# Altium schematic sheet BACKPMAN30_Intfs.SchDoc
size A3
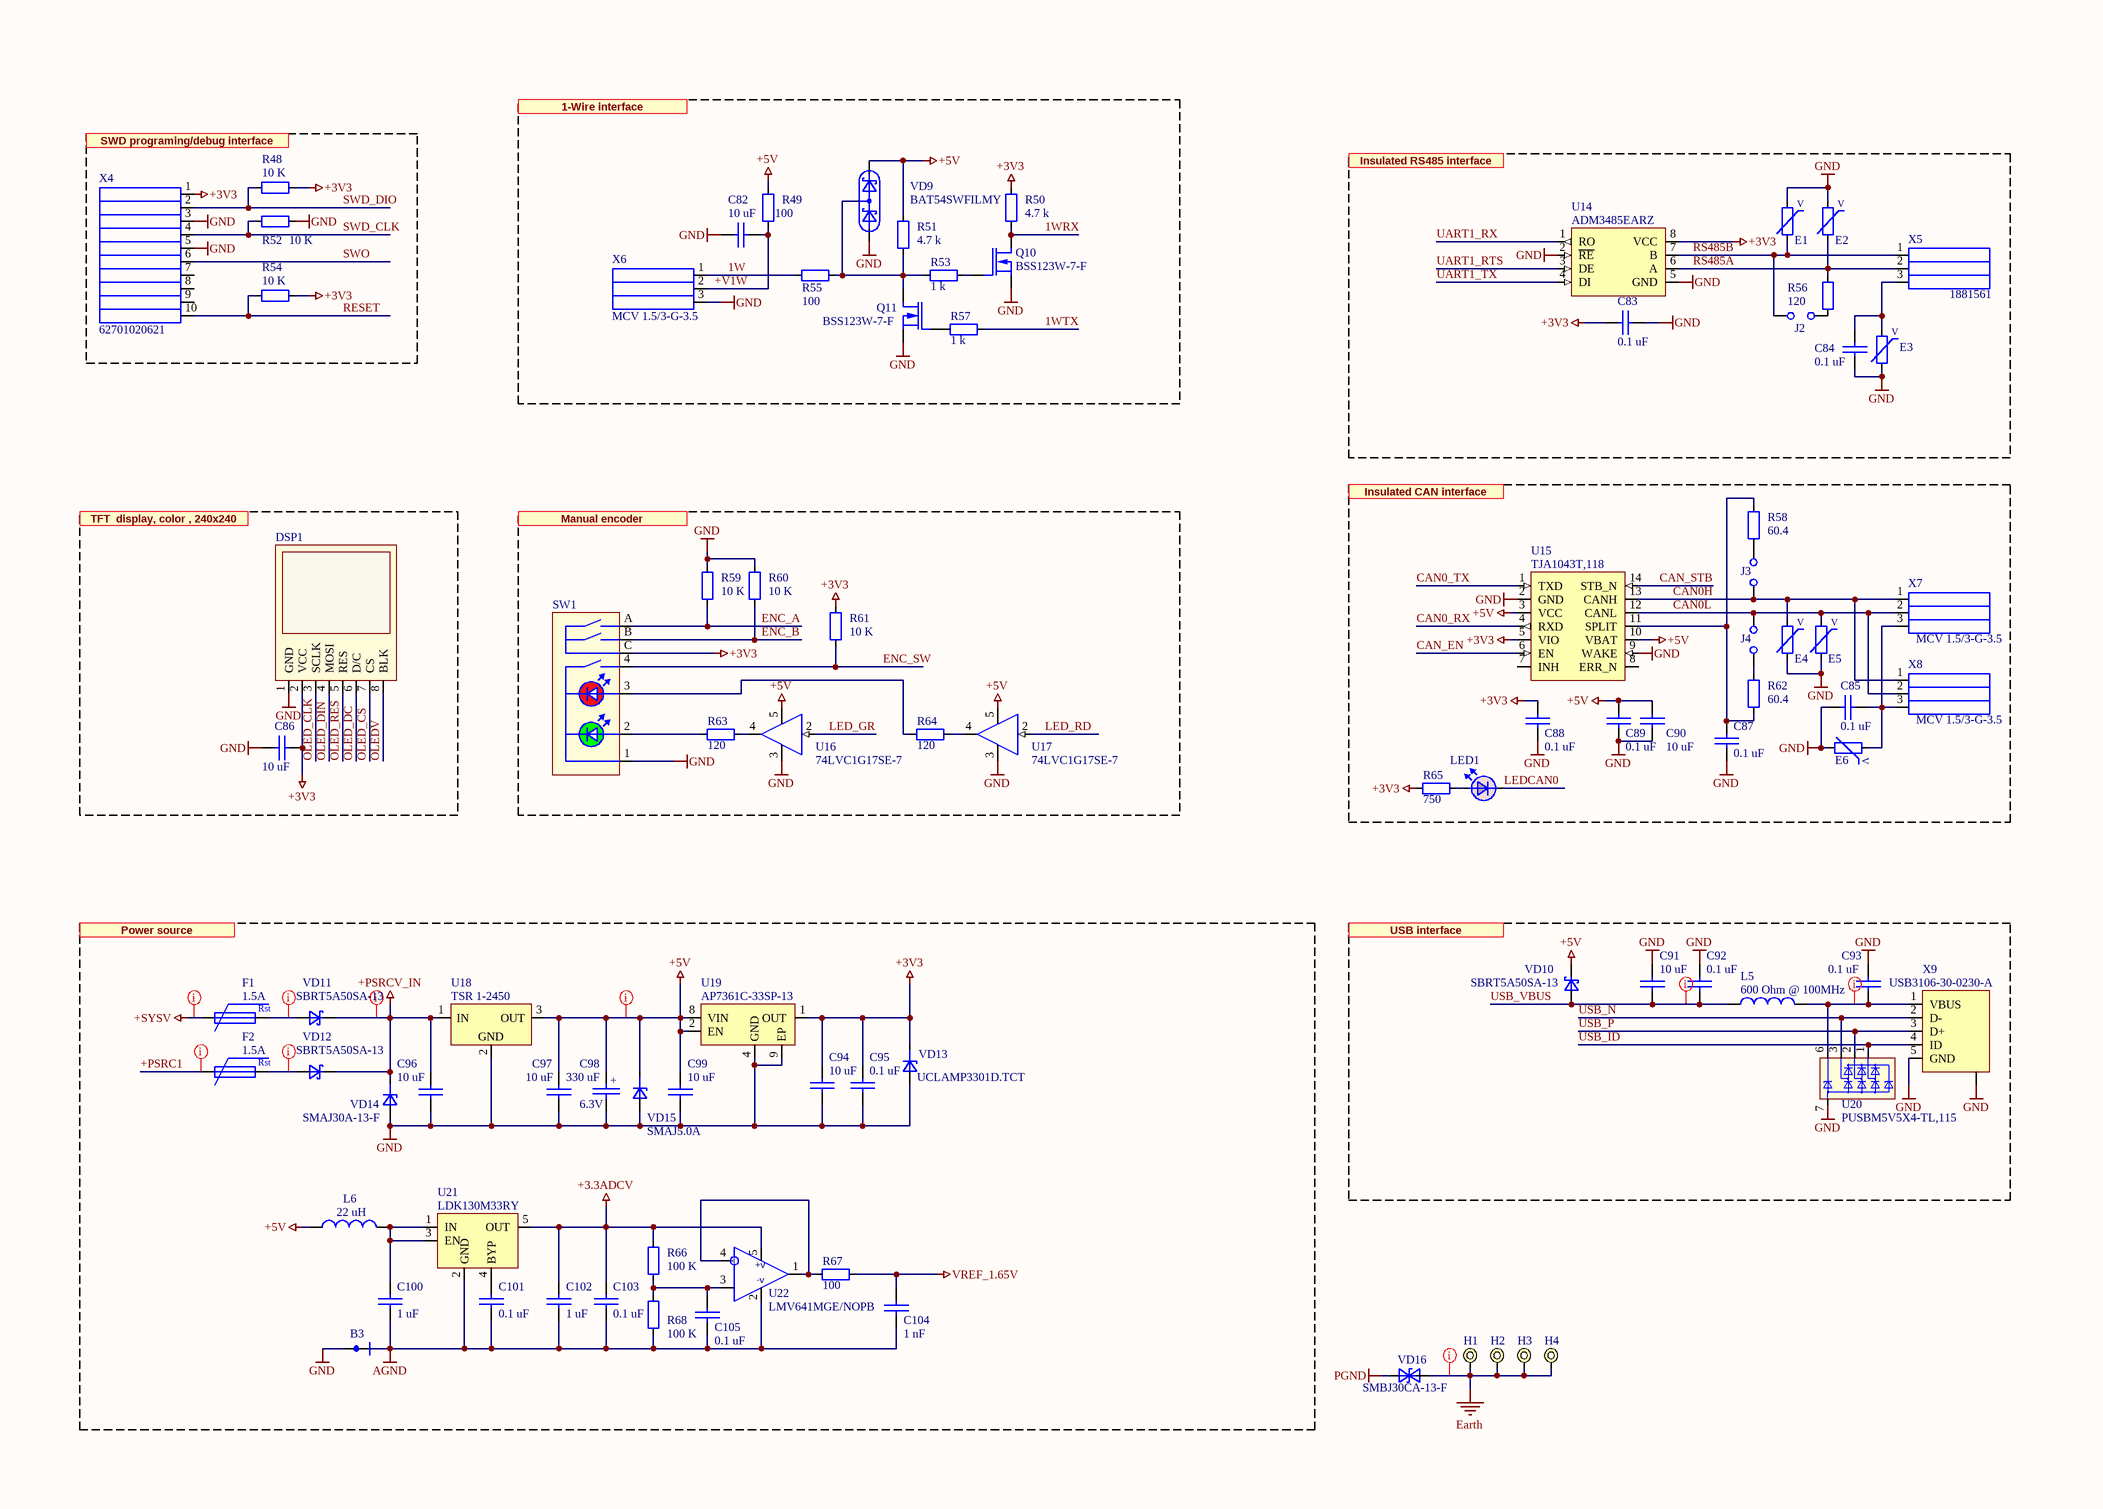
[diagram p0: BACKPMAN30_Intfs.SchDoc]

## Parts
B3  Net tie 0.3mm  [Net tee 0.3 mm]  (value not drawn)  (net tie, no BOM)
C82  value 10 uF  [2012[0805]]  (hidden comment: GRM21BR61E106KA73L)
C83  value 0.1 uF  [1608[0603]]  (hidden comment: 0603B104K500CT)
C84  value 0.1 uF  [1608[0603]]  (hidden comment: CL10B104KA8NNND)
C85  value 0.1 uF  [1608[0603]]  (hidden comment: CL10B104KA8NNND)
C86  value 10 uF  [2012[0805]]  (hidden comment: GRM21BR61E106KA73L)
C87  value 0.1 uF  [1608[0603]]  (hidden comment: CL10B104KA8NNND)
C88  value 0.1 uF  [1608[0603]]  (hidden comment: CL10B104KA8NNND)
C89  value 0.1 uF  [1608[0603]]  (hidden comment: CL10B104KA8NNND)
C90  value 10 uF  [2012[0805]]  (hidden comment: GRM21BR61E106KA73L)
C91  value 10 uF  [2012[0805]]  (hidden comment: GRM21BR61E106KA73L)
C92  value 0.1 uF  [1608[0603]]  (hidden comment: CL10B104KA8NNND)
C93  value 0.1 uF  [1608[0603]]  (hidden comment: CL10B104KA8NNND)
C94  value 10 uF  [2012[0805]]  (hidden comment: GRM21BR61E106KA73L)
C95  value 0.1 uF  [1608[0603]]  (hidden comment: CL10B104KA8NNND)
C96  value 10 uF  [3225[1210]]  (hidden comment: GMC32X7R106K50NT)
C97  value 10 uF  [2012[0805]]  (hidden comment: GRM21BR61E106KA73L)
C98  value 330 uF  Voltage: 6.3V  [T495 D]  (hidden comment: T495D337K006ATE100)
C99  value 10 uF  [2012[0805]]  (hidden comment: GRM21BR61E106KA73L)
C100  value 1 uF  [1608[0603]]  (hidden comment: C1608X5R1H105K080AB)
C101  value 0.1 uF  [1608[0603]]  (hidden comment: 0603B104K500CT)
C102  value 1 uF  [1608[0603]]  (hidden comment: C1608X5R1H105K080AB)
C103  value 0.1 uF  [1608[0603]]  (hidden comment: 0603B104K500CT)
C104  value 1 nF  [0603 CAP]  (hidden comment: Capacitor)
C105  value 0.1 uF  [1608[0603]]  (hidden comment: 0603B104K500CT)
DSP1  1.54_inch_IPS_Module  [1.54 inch IPS 240x240]  (value not drawn)
E1  ESD03A5V5R17V  [0603]  (value not drawn)
E2  ESD03A5V5R17V  [0603]  (value not drawn)
E3  823 560 505 60  [0603]  (value not drawn)
E4  ESD03A5V5R17V  [0603]  (value not drawn)
E5  ESD03A5V5R17V  [0603]  (value not drawn)
E6  ESD03A5V5R17V  [0603]  (value not drawn)
F1  value 1.5A  [2920 (7351 Metric)]  (hidden comment: 0ZCF0075AF2C)
F2  value 1.5A  [2920 (7351 Metric)]  (hidden comment: 0ZCF0075AF2C)
H1  Hole 5MM Plated  [HOLE_5MM plated]  (value not drawn)  (no BOM)
H2  Hole 5MM Plated  [HOLE_5MM plated]  (value not drawn)  (no BOM)
H3  Hole 5MM Plated  [HOLE_5MM plated]  (value not drawn)  (no BOM)
H4  Hole 5MM Plated  [HOLE_5MM plated]  (value not drawn)  (no BOM)
J2  PH1-02-TA-HT  [HDR1X2V]  (value not drawn)
J3  PH1-02-TA-HT  [HDR1X2V]  (value not drawn)
J4  PH1-02-TA-HT  [HDR1X2V]  (value not drawn)
L5  value 600 Ohm @ 100MHz  [0805]  (hidden comment: MPZ2012S601AT000)
L6  value 22 uH  [2518]  (hidden comment: BRC2518T220K)
LED1  SML-211UTT86  [0805 LED]  (value not drawn)
Q10  BSS123W-7-F  [SOT323-3]
Q11  BSS123W-7-F  [SOT323-3]
R48  value 10 K  [0603]  (hidden comment: RMCF0603FT10K0)
R49  value 100  [0603]  (hidden comment: Resistor)
R50  value 4.7 k  [0603]  (hidden comment: Resistor)
R51  value 4.7 k  [0603]  (hidden comment: Resistor)
R52  value 10 K  [0603]  (hidden comment: RMCF0603FT10K0)
R53  value 1 k  [0603]  (hidden comment: Resistor)
R54  value 10 K  [0603]  (hidden comment: RMCF0603FT10K0)
R55  value 100  [0603]  (hidden comment: Resistor)
R56  value 120  [0603]  (hidden comment: Resistor)
R57  value 1 k  [0603]  (hidden comment: Resistor)
R58  value 60.4  [0603]  (hidden comment: Resistor)
R59  value 10 K  [0603]  (hidden comment: RMCF0603FT10K0)
R60  value 10 K  [0603]  (hidden comment: RMCF0603FT10K0)
R61  value 10 K  [0603]  (hidden comment: RMCF0603FT10K0)
R62  value 60.4  [0603]  (hidden comment: Resistor)
R63  value 120  [0603]  (hidden comment: Resistor)
R64  value 120  [0603]  (hidden comment: Resistor)
R65  value 750  [0603]  (hidden comment: Resistor)
R66  value 100 K  [0603]  (hidden comment: RG1608N-104-W-T1)
R67  value 100  [0603]  (hidden comment: Resistor)
R68  value 100 K  [0603]  (hidden comment: RG1608N-104-W-T1)
SW1  PEL12D-4225S-S2024  [PEL12D-4225S-S2024]  (value not drawn)
U14  ADM3485EARZ  [SO-8]
U15  TJA1043T,118  [SOT108-1]
U16  74LVC1G17SE-7  [SOT-353 ON Semi]
U17  74LVC1G17SE-7  [SOT-353 ON Semi]
U18  TSR 1-2450  [TSR 1 Traco Power]
U19  AP7361C-33SP-13  [SOIC-8 EDP]
U20  PUSBM5V5X4-TL,115  [DFN1616-6]
U21  LDK130M33RY  [SOT23-5]
U22  LMV641MGE/NOPB  [SOT-353 ON Semi]
VD9  BAT54SWFILMY  [SOT323-3]
VD10  SBRT5A50SA-13  [SMA]
VD11  SBRT5A50SA-13  [SMA]
VD12  SBRT5A50SA-13  [SMA]
VD13  UCLAMP3301D.TCT  [SOD-323]
VD14  SMAJ30A-13-F  [SMA]
VD15  SMAJ5.0A  [SMA]
VD16  SMBJ30CA-13-F  [DO-214AA_SMBJ BI]
X4  62701020621  [SHF-105-01-L-D-SM]
X5  1881561  [1881561]
X6  MCV 1.5/3-G-3.5  [mcv1.5-3-g_3.5 green + MC 1,5 3-ST-3,5 - 1840379]
X7  MCV 1.5/3-G-3.5  [mcv1.5-3-g_3.5 green + MC 1,5 3-ST-3,5 - 1840379]
X8  MCV 1.5/3-G-3.5  [mcv1.5-3-g_3.5 green + MC 1,5 3-ST-3,5 - 1840379]
X9  USB3106-30-0230-A  [USB3106-30-0230-A]

## Nets
+3.3ADCV: C102.2 C103.1 R66.2 U21.5(OUT) U22.5(V+)
+3V3: C83.1 C86.2 C88.2 C94.2 C95.2 DSP1.2(VCC) R48.2 R50.1 R54.2 R61.2 R65.2 SW1.C U14.8(VCC) U15.5(VIO) U19.1(OUT) VD13.1(C) X4.1
+5V: C89.2 C90.2 C97.2 C98.1 C99.2 L6.1 R49.2 R51.1 U15.3(VCC) U15.10(VBAT) U16.5(VCC) U17.5(VCC) U18.3(OUT) U19.2(EN) U19.8(VIN) VD9.2 VD10.1 VD15.1
+PSRCV_IN: C96.1 U18.1(IN) VD11.1 VD12.1 VD14.1
+SYSV: F1.1
AGND: B3.1 C100.1 C101.2 C102.1 C103.2 C104.2 C105.2 R68.1 U21.2(GND) U22.2(GND)
Earth: H1.0 H2.0 H3.0 H4.0 VD16.2(A)
GND: B3.2 C82.2 C83.2 C84.2 C85.2 C86.1 C87.1 C88.1 C89.1 C90.1 C91.2 C92.2 C93.2 C94.1 C95.1 C96.2 C97.1 C98.2 C99.1 DSP1.1(GND) E1.2 E2.2 E3.1 E4.1 E5.1 E6.1 Q10.2(S) Q11.2(S) R52.2 R59.2 R60.2 SW1.1 U14.2(~{RE}) U14.5(GND) U15.2(GND) U15.9(WAKE) U16.3(GND) U17.3(GND) U18.2(GND) U19.4(GND) U19.9(EP) U20.7 VD9.1 VD13.2(A) VD14.2 VD15.2 X4.3 X4.5 X6.3 X9.0 X9.5(GND)
PGND: VD16.1(C)
VREF_1.65V: C104.1 R67.1
1W: R55.1 X6.1
1WRX: Q10.3(D) R50.2
1WTX: R57.1
+PSRC1: F2.1
+V1W: C82.1 R49.1 X6.2
CAN0_RX: U15.4(RXD)
CAN0_TX: U15.1(TXD)
CAN0H: E4.2 J3.2 U15.13(CANH) X7.1 X8.1
CAN0L: E5.2 J4.1 U15.12(CANL) X7.2 X8.2
CAN_EN: U15.6(EN)
CAN_STB: U15.14(STB_N)
ENC_A: R59.1 SW1.A
ENC_B: R60.1 SW1.B
ENC_SW: R61.1 SW1.4
LED_GR: U16.2(A)
LED_RD: U17.2(A)
LEDCAN0: LED1.2
OLED_CLK: DSP1.3(SCLK)
OLED_CS: DSP1.7(CS)
OLED_DC: DSP1.6(D/C)
OLED_DIN: DSP1.4(MOSI)
OLED_RES: DSP1.5(RES)
OLEDV: DSP1.8(BLK)
RESET: R54.1 X4.10
RS485A: E2.1 R56.2 U14.6(A) X5.2
RS485B: E1.1 J2.1 U14.7(B) X5.1
SWD_CLK: R52.1 X4.4
SWD_DIO: R48.1 X4.2
SWO: X4.6
UART1_RTS: U14.3(DE)
UART1_RX: U14.1(RO)
UART1_TX: U14.4(DI)
USB_ID: U20.1 X9.4(ID)
USB_N: U20.3 X9.2(D-)
USB_P: U20.2 X9.3(D+)
USB_VBUS: C91.1 C92.1 L5.2 VD10.2
NetC84_1: C84.1 E3.2 X5.3
NetC85_1: C85.1 E6.2 X7.3 X8.3
NetC87_2: C87.2 R58.2 R62.1 U15.11(SPLIT)
NetC93_1: C93.1 L5.1 U20.6 X9.1(VBUS)
NetC100_2: C100.2 L6.2 U21.1(IN) U21.3(EN)
NetC101_1: C101.1 U21.4(BYP)
NetC105_1: C105.1 R66.1 R68.2 U22.3(IN+)
NetF1_2: F1.2 VD11.2
NetF2_2: F2.2 VD12.2
NetJ2_2: J2.2 R56.1
NetJ3_1: J3.1 R58.1
NetJ4_2: J4.2 R62.2
NetLED1_1: LED1.1 R65.1
NetQ10_1: Q10.1(G) R53.1
NetQ11_1: Q11.1(G) R57.2
NetQ11_3: Q11.3(D) R51.2 R53.2 R55.2 VD9.3
NetR63_1: R63.1 U16.4(Y)
NetR63_2: R63.2 SW1.2
NetR64_1: R64.1 U17.4(Y)
NetR64_2: R64.2 SW1.3
NetR67_2: R67.2 U22.1(OUT) U22.4(IN-)

Not connected (* = marked no-connect by the designer): U15 7(INH) 8(ERR_N); X4 7 8 9

## Layout directives
net class 24V: +PSRC1, +PSRCV_IN, +SYSV, Earth, NetF1_2, NetF2_2
net class 5V: +5V, NetC93_1, USB_VBUS

## Notes on the sheet
- 1-Wire interface
- SWD programing/debug interface
- Insulated RS485 interface
- Insulated CAN interface
- TFT  display, color , 240x240
- (near R59) Manual encoder
- Power source
- USB interface
- (in symbol 0ZCF0075AF2C) Rst
- (in symbol ESD03A5V5R17V) V
- (in symbol LMV641MGE/NOPB) +v; -v
- (in symbol T495D337K006ATE100) +

## Library data of the parts
C82 C86 C90 C91 C94 C97 C99 = GRM21BR61E106KA73L: 10 µF ±10%, 25V, Ceramic Capacitor X5R 0805 (2012 Metric),  -55°C ~ 85°C; Manufacturer: Murata Electronics; PartNum: 490-5523-1-ND; Distributor: Digi-Key; Price: 0.11$; Tolerance: ±10%; Voltage: 25V; PartName: GRM21BR61E106KA73L
C83-C85 C87-C89 C92 C93 C95 C101 C103 C105 = 0603B104K500CT: 0.1 µF ±10% 50V Ceramic Capacitor X7R 0603 (1608 Metric), -55°C ~ 125°C; Manufacturer: Walsin Technology Corporation; PartNum: 1292-1643-1-ND; Tolerance: +-10%; Distributor: Digi-Key; PartName: 0603B104K500CT; Price: 0.0062 Euro; Voltage: 50V
C96 = GMC32X7R106K50NT: 10 µF ±10%, 50V, Ceramic Capacitor X7R, 1210 (3225 Metric), -55°C ~ 125°C; Manufacturer: CAL-CHIP ELECTRONICS, INC.; PartNum: 2571-GMC32X7R106K50NTTR-ND; Distributor: Digi-Key; PartName: GMC32X7R106K50NT; Tolerance: ±10%; Voltage: 50V
C98 = T495D337K006ATE100: 330 µF Molded Tantalum Capacitors 6.3 V 2917 (7343 Metric) 100mOhm, -55°C ~ 125°C; Manufacturer: KEMET; PartNum: 399-3883-1-ND; Tolerance: ±10%; Distributor: Digi-Key; Price: 0.089 Euro; PartName: T495D337K006ATE100
C100 C102 = C1608X5R1H105K080AB: 1 uF, ±10%, Low ESL, 50V, Ceramic Capacitor X5R 0603 (1608 Metric), -55°C ~ 85°C; Manufacturer: Venkel; PartNum: 445-7468-1-ND; Distributor: Digi-Key; PartName: C1608X5R1H105K080AB; Tolerance: ±10%; Voltage: 50V
C104 = CC0603JRX7R9BB102: 1000pF, ±5%, 50V, X7R, 0603 (1608 Metric), -55°C ~ 125°C, -, General Purpose; Manufacturer: Yageo; PartNum: 311-3361-1-ND; Voltage - Rated: 50V; Part Number: CC0603JRX7R9BB102; Distributor: Digi-Key; PartName: CC0603JRX7R9BB102; Price: 0.01920; Tolerance: ±5%; Temperature Coefficient: X7R; Operating Temperature: -55°C ~ 125°C; Features: -; Package / Case: 0603 (1608 Metric)
DSP1 = 1.54_inch_IPS_Module: 1.54-inch color screen,support 65K color display, 4-line SPI interface, 240x240 resolution, 32.00x43.72 mm; PartNum: MSP1541; PartName: 1.54 inch IPS Module; Distributor: Aliexpress; Price: 7.36
E1-E6 = ESD03A5V5R17V: Low and Ultra Low Capacitance ESD Suppressor, Voperating=5.5V, Vclamp=17V, < 1nS,1nA, 0603,; Manufacturer: Stackpole Electronics Inc; PartNum: ESD03A5V5R17VCT-ND; Voltage: 17V; Distributor: Digi-Key; PartName: ESD03A5V5R17V; Price: 0.1$
F1 F2 = 0ZCF0075AF2C: PTC RESETTABLE 60V 750MA, It=1.5A, 0.3s 2920(7351); Manufacturer: Bel Fuse Inc.; PartNum: 507-1743-1-ND; Distributor: Digi-Key; PartName: 0ZCF0075AF2C
J2-J4 = PH1-02-UA: Connector Header Through Hole 2 position 0.100" (2.54mm), Contact Length - Mating 6 mm; Manufacturer: Adam Tech; PartNum: 2057-PH1-02-UA-ND; Distributor: Digi-Key; PartName: PH1-02-UA
L5 = MPZ2012S601AT000: FERRITE BEAD 600 OHM, 0805, -55°C ~ 125°C; Manufacturer: TDK Corporation; PartNum: 445-2206-1-ND; Distributor: Digi-Key; Price: 0.05$; PartName: MPZ2012S601AT000
L6 = BRC2518T220K: 22 µH Unshielded Wirewound Inductor, 490 mA, 560mOhm, 1007 (2518 Metric); Manufacturer: Taiyo Yuden; PartNum: 587-2439-1-ND; Tolerance: ±10%; Distributor: Digi-Key; PartName: BRC2518T220K; Supplier 1: Digi-Key; Supplier Part Number 1: 587-2439-1-ND
LED1 = SML-211UTT86: 0805 red LED, hibright, 2 mA, 1.8V, 130°; Manufacturer: Rohm; PartNum: 511-1292-1-ND; Distributor: Digi-Key; Price: 0.34$; Value: Red; PartName: SML-211UTT86
Q10 Q11 = BSS123W-7-F: MOSFETs N-CH, 2V @ 1mA, 6 Ohm @ 170mA, 10V, 170mA, 100V, SOT-323,  -55°C ~ 150°C; Manufacturer: Diodes Incorporated; PartNum: BSS123W-FDICT-ND; Distributor: Digi-Key; Price: 0.15$; PartName: BSS123W-7-F
R48 R52 R54 R59-R61 = RMCF0603FT10K0: 10 kOhms ±1%, ±100ppm/°C,  0.1W, 1/10W Chip Resistor 0603 (1608 Metric) Automotive AEC-Q200 Thick Film, -55°C ~ 155°C; Manufacturer: Stackpole Electronics Inc; PartNum: RMCF0603FT10K0CT-ND; Distributor: Digi-Key; Price: 0.0017$; Tolerance: 1%; PartName: RMCF0603FT10K0
R49 R55 R67 = RMCF0603FT100R: 100 Ohms, ±1%, 0.1W, 1/10W, Thick Film, ±100ppm/°C, 0603 (1608 Metric), -55°C ~ 155°C, Automotive AEC-Q200; Manufacturer: Stackpole Electronics Inc.; PartNum: RMCF0603FT100RCT-ND; Voltage: 75V; Distributor: Digi-Key; Price: 0.00690; Tolerance: ±1%; PartName: RMCF0603FT100R; Part Number: RMCF0603FT100R; Temperature Coefficient: ±100ppm/°C; Operating Temperature: -55°C ~ 155°C; Power (Watts): 0.1W, 1/10W; Features: Automotive AEC-Q200; Package / Case: 0603 (1608 Metric)
R50 R51 = RMCF0603FT4K70: 4.7 kOhms, ±1%, 0.1W, 1/10W, Thick Film, ±100ppm/°C, 0603 (1608 Metric), -55°C ~ 155°C, Automotive AEC-Q200; Manufacturer: Stackpole Electronics Inc.; PartNum: RMCF0603FT4K70CT-ND; Voltage: 75V; Distributor: Digi-Key; Price: 0.00690; Tolerance: ±1%; PartName: RMCF0603FT4K70; Part Number: RMCF0603FT4K70; Temperature Coefficient: ±100ppm/°C; Operating Temperature: -55°C ~ 155°C; Power (Watts): 0.1W, 1/10W; Features: Automotive AEC-Q200; Package / Case: 0603 (1608 Metric)
R53 R57 = RMCF0603FG1K00: 1 kOhms, ±1%, 0.1W, 1/10W, Thick Film, ±100ppm/°C, 0603 (1608 Metric), -55°C ~ 155°C, Automotive AEC-Q200; Manufacturer: Stackpole Electronics Inc.; PartNum: RMCF0603FG1K00CT-ND; Voltage: 75V; Distributor: Digi-Key; Price: 0.00690; Tolerance: ±1%; PartName: RMCF0603FG1K00; Part Number: RMCF0603FG1K00; Temperature Coefficient: ±100ppm/°C; Operating Temperature: -55°C ~ 155°C; Power (Watts): 0.1W, 1/10W; Features: Automotive AEC-Q200; Package / Case: 0603 (1608 Metric)
R56 R63 R64 = RMCF0603FT120R: 120 Ohms, ±1%, 0.1W, 1/10W, Thick Film, ±100ppm/°C, 0603 (1608 Metric), -55°C ~ 155°C, Automotive AEC-Q200; Manufacturer: Stackpole Electronics Inc.; PartNum: RMCF0603FT120RCT-ND; Voltage: 75V; Distributor: Digi-Key; Price: 0.00690; Tolerance: ±1%; PartName: RMCF0603FT120R; Temperature Coefficient: ±100ppm/°C; Operating Temperature: -55°C ~ 155°C; Power (Watts): 0.1W, 1/10W; Features: Automotive AEC-Q200; Package / Case: 0603 (1608 Metric)
  R63 R64: Part Number: RMCF0603FT120R
R58 R62 = CRCW060360R4FKEA: 60.4 Ohms, ±1%, 0.1W, 1/10W, Thick Film, ±100ppm/°C, 0603 (1608 Metric), -55°C ~ 155°C, Automotive AEC-Q200; Manufacturer: Vishay Dale; PartNum: 541-60.4HCT-ND; Voltage: 75V; Distributor: Digi-Key; Price: 0.01700; Tolerance: ±1%; PartName: CRCW060360R4FKEA; Part Number: CRCW060360R4FKEA; Temperature Coefficient: ±100ppm/°C; Operating Temperature: -55°C ~ 155°C; Power (Watts): 0.1W, 1/10W; Features: Automotive AEC-Q200; Package / Case: 0603 (1608 Metric)
R65 = RMCF0603FT750R: 750 Ohms, ±1%, 0.1W, 1/10W, Thick Film, ±100ppm/°C, 0603 (1608 Metric), -55°C ~ 155°C, Automotive AEC-Q200; Manufacturer: Stackpole Electronics Inc.; PartNum: RMCF0603FT750RCT-ND; Voltage: 75V; Distributor: Digi-Key; Price: 0.00690; Tolerance: ±1%; PartName: RMCF0603FT750R; Temperature Coefficient: ±100ppm/°C; Operating Temperature: -55°C ~ 155°C; Power (Watts): 0.1W, 1/10W; Features: Automotive AEC-Q200; Package / Case: 0603 (1608 Metric)
R66 R68 = RG1608N-104-W-T1: 100 kOhms ±0.05% 0.1W, 1/10W Chip Resistor 0603 (1608 Metric) Anti-Sulfur, Automotive AEC-Q200 Thin Film,-55°C ~ 155°C; Manufacturer: Susumu; PartNum: RG16N100KWCT-ND; Distributor: Digi-Key; Price: 0.002$; Tolerance: ±0.05%; PartName: RG1608N-104-W-T1
SW1 = PEL12D-4225S-S2024: Rotary Encoder Mechanical 24 Quadrature (Incremental) Vertical; Manufacturer: Bourns Inc.; PartNum: PEL12D-4225S-S2024-ND; Distributor: Digi-Key; PartName: PEL12D-4225S-S2024; Price: 3.62$
U14 = ADM3485EARZ: 1/1 Transceiver Half RS422, RS485, VCC 3.3 V,  8-SOIC, -40°C ~ 85°C; Manufacturer: Analog Devices; PartNum: 584-ADM3485EARZ-R7; Price: 2.35$; Distributor: Mouser; PartName: ADM3485EARZ
U15 = TJA1043T,118: 1/1 Transceiver Half CANbus, 5Mbps, 4.5-5.5V, 3V IO,  14-SO, -40°C ~ 150°C; Manufacturer: NXP; PartNum: 2776120RL; Price: 1.41; Distributor: Farnell; PartName: TJA1043T,118
U16 U17 = 74LVC1G17SE-7: IC SGL SCHMITT BUFFER SOT353; Manufacturer: Diodes Incorporated; PartNum: 74LVC1G17SE-7CT-ND; Distributor: Digi-Key; PartName: 74LVC1G17SE-7
U18 = TSR 1-2450: Linear Regulator Replacement DC DC Converter 5W, 5V, 1A, 6.5V - 36V Input, -40°C ~ 85°C; Manufacturer: Traco Power; PartNum: 1951-2747-ND; Distributor: Digi-Key; price: 3.9$; PartName: TSR 1-2450
U19 = AP7361C-33SP-13: LDO, 3.3 V, 1A, 0.36V@1A, Vin=6V max, -40..+85C, 8-SO-EP; PartNum: AP7361C-33SP-13DICT-ND; Manufacturer: Diodes Incorporated; Distributor: Digi-Key; Price: 0.56$; PartName: AP7361C-33SP-13
U20 = PUSBM5V5X4-TL,115: TVS DIODE 5.5VWM 12VC 6HXSON; Manufacturer: NXP Semiconductors; PartNum: 568-10921-1-ND; Distributor: Digi-Key; PartName: PUSBM5V5X4-TL,115
U21 = LDK130M33RY: LDO 3.3 V, 250 mA, Vin < 5.5V, Iq < 12uA, -40..+125 C, SOT23-5; Manufacturer: STMicroelectronics; PartNum: 511-LDK130M33RY; Price: 0.543; Distributor: Mouser; PartName: LDK130M33RY
U22 = LMV641MGE/NOPB: OpAmp,  Rail-to-Rail,  10MHz, VSS 2.7V ~ 12V, Vofs 30µV,  SC-70-5, -40°C ~ 125°C; Manufacturer: Texas Instruments; PartNum: LMV641MGE/NOPBCT-ND; Price: 1.8$; Distributor: Digi-Key; PartName: LMV641MGE/NOPB; Supplier 1: Digi-Key; Supplier Part Number 1: 296-OPA991IDBVRCT-ND
VD9 = BAT54SWFILMY: Series Shottky Diodes array, 40V, 300 mA, SOT-323, -40°C...150°C; Manufacturer: STMicroelectronics; PartNum: 497-17757-1-ND; Distributor: Digi-Key; PartName: BAT54SWFILMY
VD10-VD12 = SBRT5A50SA-13: Schottky Power Rectifier 3A, 40V, SMA; Manufacturer: Diodes Incorporated; PartNum: SBRT5A50SA-13DICT-ND; Price: 0,15$; Distributor: Digi-Key; PartName: SBRT5A50SA-13
VD13 = UCLAMP3301D.TCT: TVS 3.3V (Max), Vbr=3.5V, 9.5V Clamp 10A (8/20µs) Ipp Tvs Diode Surface Mount SOD-323; Manufacturer: Semtech Corporation; PartNum: UCLAMP3301DCT-ND; Distributor: Digi-Key; Value: 3.3V; PartName: UCLAMP3301D.TCT
VD14 = SMAJ30A-13-F: 48.4V Clamp 8.3A Ipp Tvs Diode Surface Mount SMA,; Manufacturer: Diodes Incorporated; PartNum: SMAJ30A-FDICT-ND; Voltage: 30 V; Distributor: Digi-Key; Price: 0.18$; PartName: SMAJ30A-13-F
VD15 = SMAJ5.0A: 9.2V Clamp 43.5A Ipp Tvs Diode Surface Mount SMA, -55°C ~ 150°C (TJ); Manufacturer: Littelfuse Inc.; PartNum: SMAJ5.0ALFCT-ND; Voltage: 30 V; Distributor: Digi-Key; Price: 0.18$; PartName: SMAJ5.0A
VD16 = SMBJ30CA-13-F: TVS 600W, Vbr=33.3V, Vcl=48.4V,  Bidirectional, SMB, -55°C ~ 150°C; Manufacturer: Diodes Incorporated; PartNum: SMBJ30CA-FDICT-ND; Voltage: 30V; Distributor: Digi-Key; Price: 0.21$; PartName: SMBJ30CA-13-F; Supplier 1: Digi-Key; Supplier Part Number 1: SMBJ30CA-FDICT-ND
X4 = 62701020621: 10 Positions Header Connector 0.050" (1.27mm) Surface Mount Gold; Manufacturer: Wurth; Distributor: we-online.com; Price: 4.36$; PartNum: 62701020621; PartName: 62701020621
X5 = 1881561: Printed-circuit board connector - MCV 0,5/ 3-G-2,5 - 1881561; Manufacturer: Phoenix Contact; Distributor: Phoenix Contact; Price: 0.33; PartNum: 1881561; PartName: MCV 0,5/ 3-G-2,5
X6-X8 = MCV 1.5/3-G-3.5: HEADER, VERTICAL, 3.5MM, 3WAY; Manufacturer: PHOENIX CONTACT; PartNum: 1843619; PartName: MCV 1,5/3-G-3,5; Distributor: Farnell
X9 = USB3106-30-0230-A: USB - micro AB USB 2.0 Receptacle Connector 5 Position Through Hole; Manufacturer: GCT; PartNum: 2073-USB3106-30-0230-ACT-ND; Distributor: Digi-Key; Price: 0.63$; PartName: USB3106-30-0230-A